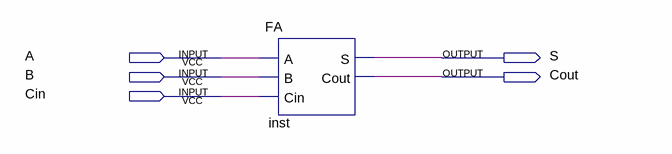
[diagram p0: schematic sheet]
// Quartus schematic lab4-FA_1bit.bdf as structural Verilog: 1 symbols, 5 pins
module \lab4-FA_1bit  (
  input  A,
  input  B,
  input  Cin,
  output S,
  output Cout
);

  FA inst (.A(A), .B(B), .Cin(Cin), .S(S), .Cout(Cout));
endmodule
